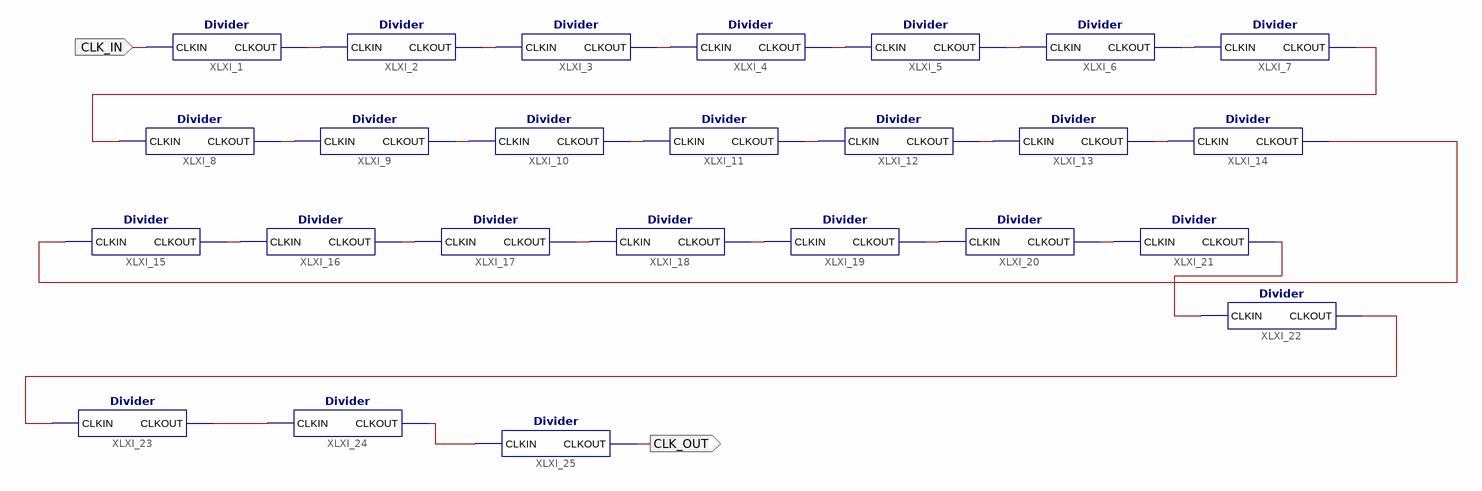
[diagram p0: schematic sheet 1]
// Xilinx ISE schematic HZ1.sch (spartan6) as structural Verilog: 25 symbols, 2 ports
module HZ1 (
  input  CLK_IN,
  output CLK_OUT
);

  wire XLXN_1, XLXN_2, XLXN_3, XLXN_4, XLXN_5, XLXN_6, XLXN_7, XLXN_8, XLXN_9, XLXN_10, XLXN_11, XLXN_12,
       XLXN_13, XLXN_14, XLXN_15, XLXN_16, XLXN_17, XLXN_18, XLXN_19, XLXN_20, XLXN_21, XLXN_22, XLXN_23,
       XLXN_26;

  Divider XLXI_1 (.CLKIN(CLK_IN), .CLKOUT(XLXN_1));
  Divider XLXI_2 (.CLKIN(XLXN_1), .CLKOUT(XLXN_2));
  Divider XLXI_3 (.CLKIN(XLXN_2), .CLKOUT(XLXN_3));
  Divider XLXI_4 (.CLKIN(XLXN_3), .CLKOUT(XLXN_4));
  Divider XLXI_5 (.CLKIN(XLXN_4), .CLKOUT(XLXN_5));
  Divider XLXI_6 (.CLKIN(XLXN_5), .CLKOUT(XLXN_6));
  Divider XLXI_7 (.CLKIN(XLXN_6), .CLKOUT(XLXN_22));
  Divider XLXI_8 (.CLKIN(XLXN_22), .CLKOUT(XLXN_7));
  Divider XLXI_9 (.CLKIN(XLXN_7), .CLKOUT(XLXN_8));
  Divider XLXI_10 (.CLKIN(XLXN_8), .CLKOUT(XLXN_9));
  Divider XLXI_11 (.CLKIN(XLXN_9), .CLKOUT(XLXN_10));
  Divider XLXI_12 (.CLKIN(XLXN_10), .CLKOUT(XLXN_11));
  Divider XLXI_13 (.CLKIN(XLXN_11), .CLKOUT(XLXN_12));
  Divider XLXI_14 (.CLKIN(XLXN_12), .CLKOUT(XLXN_23));
  Divider XLXI_15 (.CLKIN(XLXN_23), .CLKOUT(XLXN_13));
  Divider XLXI_16 (.CLKIN(XLXN_13), .CLKOUT(XLXN_14));
  Divider XLXI_17 (.CLKIN(XLXN_14), .CLKOUT(XLXN_15));
  Divider XLXI_18 (.CLKIN(XLXN_15), .CLKOUT(XLXN_16));
  Divider XLXI_19 (.CLKIN(XLXN_16), .CLKOUT(XLXN_17));
  Divider XLXI_20 (.CLKIN(XLXN_17), .CLKOUT(XLXN_18));
  Divider XLXI_21 (.CLKIN(XLXN_18), .CLKOUT(XLXN_19));
  Divider XLXI_22 (.CLKIN(XLXN_19), .CLKOUT(XLXN_26));
  Divider XLXI_25 (.CLKIN(XLXN_21), .CLKOUT(CLK_OUT));
  Divider XLXI_24 (.CLKIN(XLXN_20), .CLKOUT(XLXN_21));
  Divider XLXI_23 (.CLKIN(XLXN_26), .CLKOUT(XLXN_20));
endmodule
